# Altium schematic sheet conn_ant_sch.SchDoc
size A4; Organization1: VINCULADA AO EXÉRCITO BRASILEIRO; Organization2: FÁBRICA DE MATERIAL DE; Organization3: COMUNICAÇÕES E ELETRÔNICA; Organization0: INDÚSTRIA DE MATERIAL BÉLICO DO BRASIL; Esquematico: Esquemático
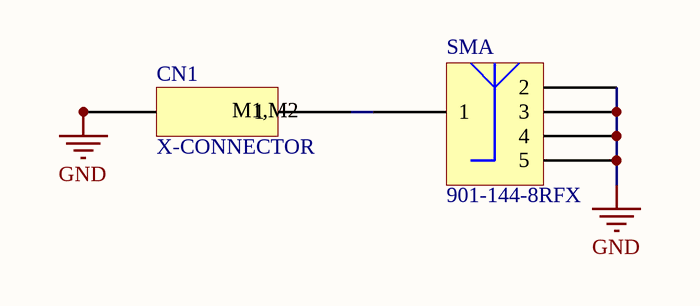
[diagram p0: conn_ant_sch.SchDoc]

## Parts
CN1  X-CONNECTOR  [X-CONNECTOR-PCB]
SMA  901-144-8RFX  [901-144-8RFX-Footprint-1]

## Nets
GND: CN1.M1 CN1.M2 SMA.2 SMA.3 SMA.4 SMA.5
NetCN1_1: CN1.1 SMA.1

## Notes on the sheet
- USADO EQUIP.:
- DATA:
- ENG:
- VERIF:
- HORA:
- REV:
- APROV:
- TÍTULO:
- FOLHA:
- /
- FORMATO:
- A4
- CÓDIGO:
- ESTOQUE:
- (in symbol X-CONNECTOR-5) M1,M2

## Library data of the parts
CN1 = X-CONNECTOR-5: CONECTOR PARA MÓDULOS X MICROWAVE; RoHS: Yes; Mount: TH
SMA = 901-144-8RFX-01.A.2: CONN SMA JACK STR 50 OHM PCB; Connector Type: SMA, Coaxial, Socket; Insulation Resistance: 5GR; Polarity: Standard; Max Frequency: 18GHz; Gender: Female; Body Material: Brass; Plating: Gold; Dielectric Material: PTFE; Impedance: 50R; Mating Cycles: 100; Frequency: 18Hz; Mount: Through Hole; Fastening Type: Threaded; Termination: Solder; Orientation: Straight; Length: 7mm; Height: 9.53mm; Depth: 7mm; Case/Package: SMA; Weight: 0.054322oz; Contact Material: Copper; Contact Plating: Gold; Body Plating: Gold; Housing Colour: Gold; Material: Brass; Insulation Material: Tetrafluoroethylene; Min Operating Temperature: -65°C; Max Operating Temperature: 165°C; Packaging: Bulk; Package Quantity: 1; Radiation Hardening: No; REACH SVHC: Unknown; Lead Free: Lead Free